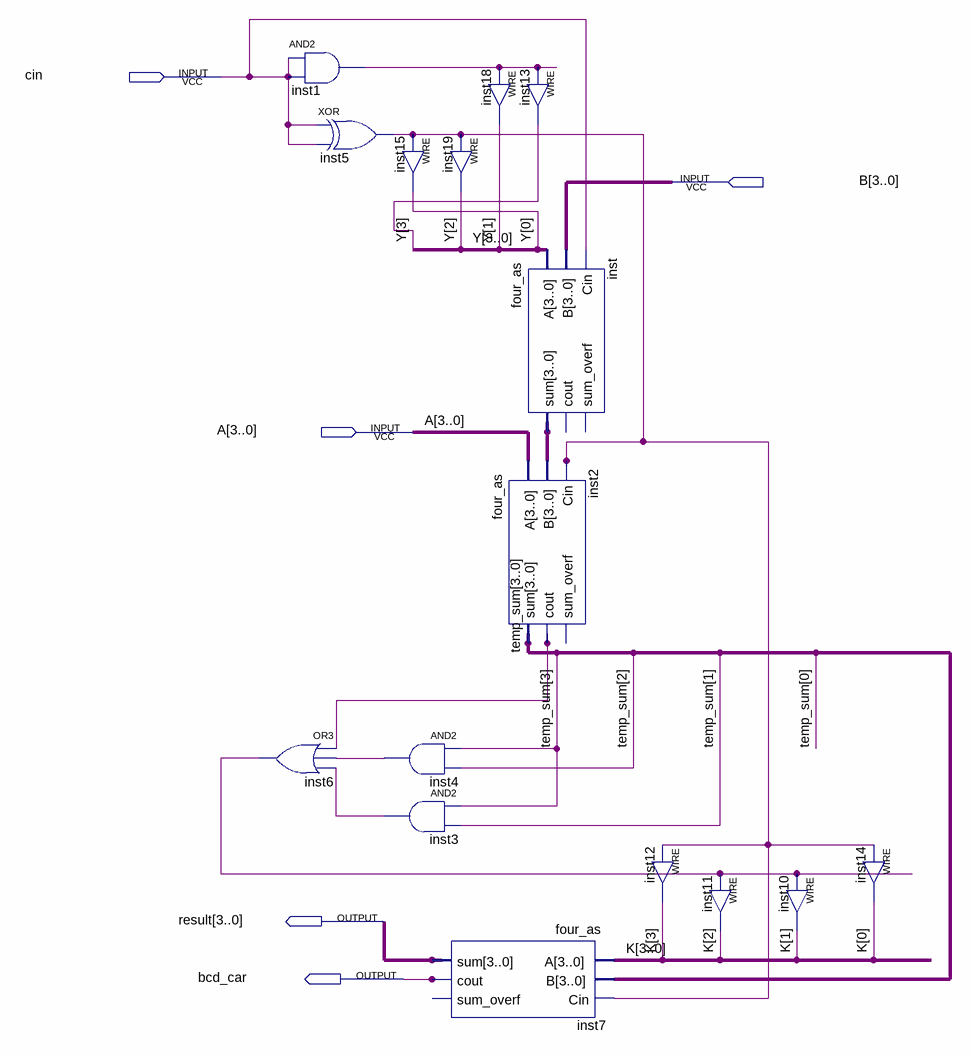
[diagram p0: schematic sheet]
// Quartus schematic bcdas_schema.bdf as structural Verilog: 16 symbols, 5 pins
module bcdas_schema (
  input  cin,
  input  [3:0] B,
  input  [3:0] A,
  output [3:0] result,
  output bcd_car
);

  wire inst1_out, inst2_cout, inst3_out, inst4_out, inst5_out, inst6_out;
  wire [3:0] inst_sum, K, temp_sum, Y;

  and inst1 (inst1_out, cin, cin);
  or inst6 (inst6_out, inst2_cout, inst4_out, inst3_out);
  xor inst5 (inst5_out, cin, cin);
  assign Y[0] = inst5_out;  // WIRE inst15
  assign Y[2] = inst5_out;  // WIRE inst19
  and inst4 (inst4_out, temp_sum[3], temp_sum[2]);
  and inst3 (inst3_out, temp_sum[3], temp_sum[1]);
  four_as inst7 (.A(K), .B(temp_sum), .Cin(inst5_out), .sum(result), .cout(bcd_car));  // open: sum_overf
  assign Y[3] = inst1_out;  // WIRE inst13
  assign Y[1] = inst1_out;  // WIRE inst18
  four_as inst (.A(Y), .B(B), .Cin(cin), .sum(inst_sum));  // open: cout, sum_overf
  four_as inst2 (.A(A), .B(inst_sum), .Cin(inst5_out), .sum(temp_sum), .cout(inst2_cout));  // open: sum_overf
  assign K[3] = inst5_out;  // WIRE inst12
  assign K[2] = inst6_out;  // WIRE inst11
  assign K[1] = inst6_out;  // WIRE inst10
  assign K[0] = inst5_out;  // WIRE inst14
endmodule
